# Altium schematic sheet Tiras LED.SchDoc
size A4
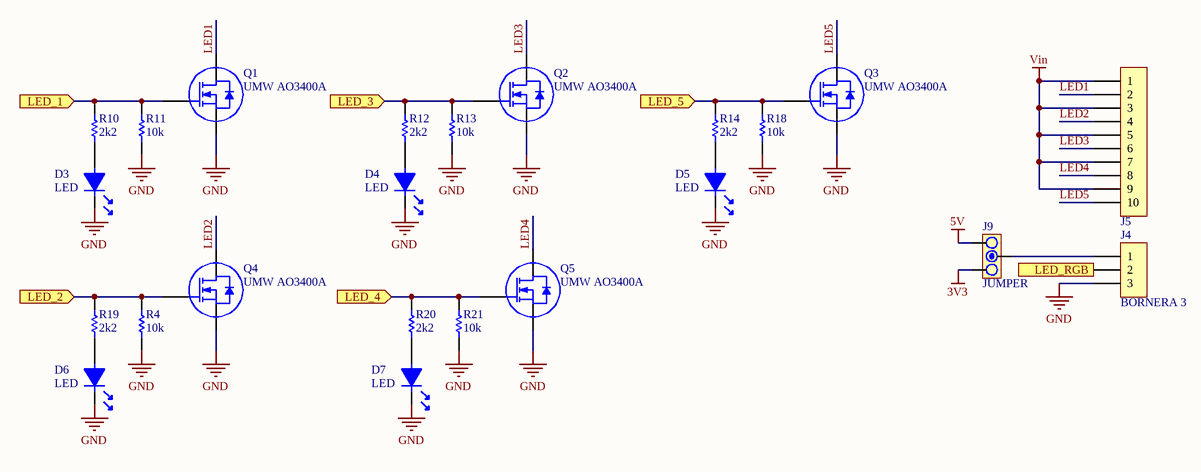
[diagram p0: Tiras LED.SchDoc]

## Parts
D3  LED  [LED0805]
D4  LED  [LED0805]
D5  LED  [LED0805]
D6  LED  [LED0805]
D7  LED  [LED0805]
J4  BORNERA 3  [BORNERA3]
J5  BORNERA10  [BORNERA10]  (value not drawn)
J9  JUMPER  [JUMPER3]
Q1  UMW AO3400A  [SOT23]
Q2  UMW AO3400A  [SOT23]
Q3  UMW AO3400A  [SOT23]
Q4  UMW AO3400A  [SOT23]
Q5  UMW AO3400A  [SOT23]
R4  10k  [0805]
R10  2k2  [0805]
R11  10k  [0805]
R12  2k2  [0805]
R13  10k  [0805]
R14  2k2  [0805]
R18  10k  [0805]
R19  2k2  [0805]
R20  2k2  [0805]
R21  10k  [0805]

## Ports
LED_1 (in), LED_2 (in), LED_3 (in), LED_4 (in), LED_5 (in), LED_RGB (in)

## Nets
3V3: J9.1
5V: J9.3
GND: D3.2 D4.2 D5.2 D6.2 D7.2 J4.3 Q1.3(S) Q2.3(S) Q3.3(S) Q4.3(S) Q5.3(S) R4.1 R11.1 R13.1 R18.1 R21.1
Vin: J5.1 J5.3 J5.5 J5.7 J5.9
LED1: J5.2 Q1.2(D)
LED2: J5.4 Q4.2(D)
LED3: J5.6 Q2.2(D)
LED4: J5.8 Q5.2(D)
LED5: J5.10 Q3.2(D)
LED_1: Q1.1(G) R10.2 R11.2 ; port LED_1
LED_2: Q4.1(G) R4.2 R19.2 ; port LED_2
LED_3: Q2.1(G) R12.2 R13.2 ; port LED_3
LED_4: Q5.1(G) R20.2 R21.2 ; port LED_4
LED_5: Q3.1(G) R14.2 R18.2 ; port LED_5
LED_RGB: J4.2 ; port LED_RGB
NetD3_1: D3.1 R10.1
NetD4_1: D4.1 R12.1
NetD5_1: D5.1 R14.1
NetD6_1: D6.1 R19.1
NetD7_1: D7.1 R20.1
NetJ4_1: J4.1 J9.2

## Library data of the parts
J9 = JUMPER3
Q1-Q5 = MOSFET N
R4 R10-R14 R18-R21 = RES